# EAGLE schematic 2_dsub to pins (EAGLE 7.2.0)
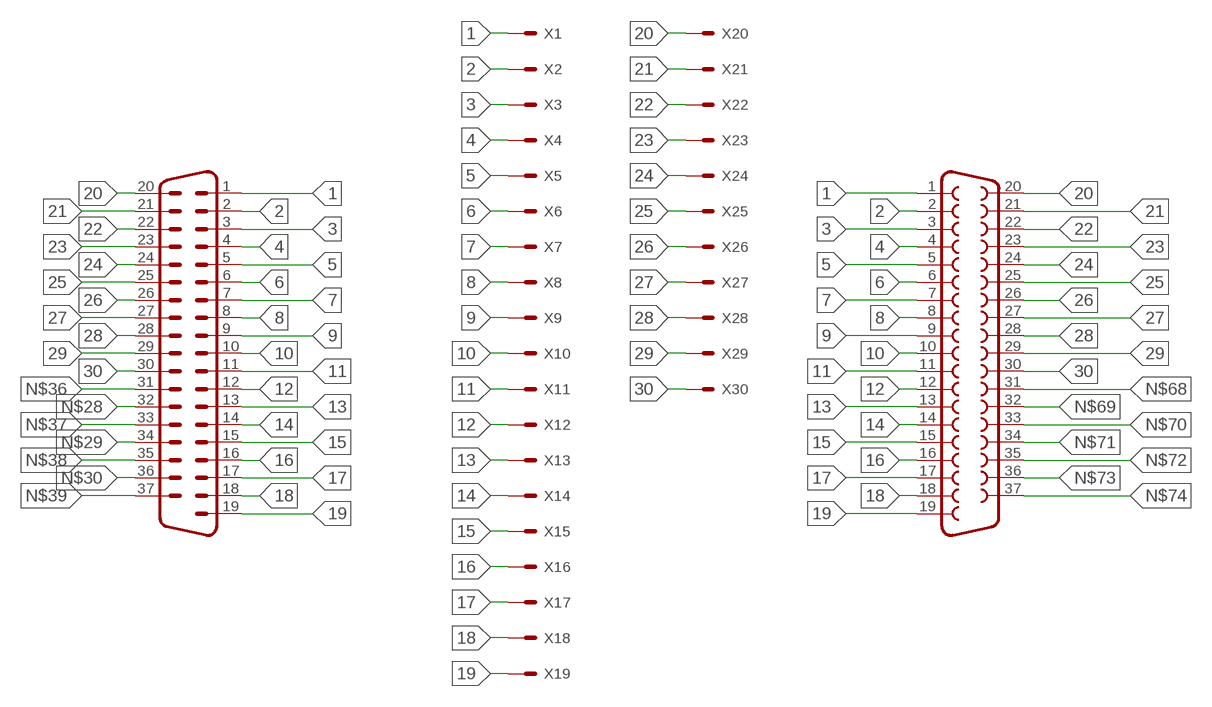
[diagram p0: schematic, sheet 1]

## Parts
X1  22-23-2021  [22-23-2021]
X2  22-23-2021  [22-23-2021]
X3  22-23-2021  [22-23-2021]
X4  22-23-2021  [22-23-2021]
X5  22-23-2021  [22-23-2021]
X6  22-23-2021  [22-23-2021]
X7  22-23-2021  [22-23-2021]
X8  22-23-2021  [22-23-2021]
X9  22-23-2021  [22-23-2021]
X10  22-23-2021  [22-23-2021]
X11  22-23-2021  [22-23-2021]
X12  22-23-2021  [22-23-2021]
X13  22-23-2021  [22-23-2021]
X14  22-23-2021  [22-23-2021]
X15  22-23-2021  [22-23-2021]
X16  22-23-2021  [22-23-2021]
X17  22-23-2021  [22-23-2021]
X18  22-23-2021  [22-23-2021]
X19  22-23-2021  [22-23-2021]
X20  22-23-2021  [22-23-2021]
X21  22-23-2021  [22-23-2021]
X22  22-23-2021  [22-23-2021]
X23  22-23-2021  [22-23-2021]
X24  22-23-2021  [22-23-2021]
X25  22-23-2021  [22-23-2021]
X26  22-23-2021  [22-23-2021]
X27  22-23-2021  [22-23-2021]
X28  22-23-2021  [22-23-2021]
X29  22-23-2021  [22-23-2021]
X30  22-23-2021  [22-23-2021]
X33  M37HP  [M37HP]
X34  F37HP  [F37HP]

## Nets
1: X1.1(S) X33.1 X34.1
2: X2.1(S) X33.2 X34.2
3: X3.1(S) X33.3 X34.3
4: X4.1(S) X33.4 X34.4
5: X5.1(S) X33.5 X34.5
6: X6.1(S) X33.6 X34.6
7: X7.1(S) X33.7 X34.7
8: X8.1(S) X33.8 X34.8
9: X9.1(S) X33.9 X34.9
10: X10.1(S) X33.10 X34.10
11: X11.1(S) X33.11 X34.11
12: X12.1(S) X33.12 X34.12
13: X13.1(S) X33.13 X34.13
14: X14.1(S) X33.14 X34.14
15: X15.1(S) X33.15 X34.15
16: X16.1(S) X33.16 X34.16
17: X17.1(S) X33.17 X34.17
18: X18.1(S) X33.18 X34.18
19: X19.1(S) X33.19 X34.19
20: X20.1(S) X33.20 X34.20
21: X21.1(S) X33.21 X34.21
22: X22.1(S) X33.22 X34.22
23: X23.1(S) X33.23 X34.23
24: X24.1(S) X33.24 X34.24
25: X25.1(S) X33.25 X34.25
26: X26.1(S) X33.26 X34.26
27: X27.1(S) X33.27 X34.27
28: X28.1(S) X33.28 X34.28
29: X29.1(S) X33.29 X34.29
30: X30.1(S) X33.30 X34.30
N$28: X33.32
N$29: X33.34
N$30: X33.36
N$36: X33.31
N$37: X33.33
N$38: X33.35
N$39: X33.37
N$68: X34.31
N$69: X34.32
N$70: X34.33
N$71: X34.34
N$72: X34.35
N$73: X34.36
N$74: X34.37

## Library data of the parts
X1-X30 = mayo:22-23-2021: .100" (2.54mm) Center Header - 1 Pin; MF: MOLEX; MPN: 22-23-2021; OC_FARNELL: 1462926; OC_NEWARK: 25C3832
X33 = con-subd:M37: SUB-D; OC_FARNELL: unknown; OC_NEWARK: unknown
X34 = con-subd:F37: SUB-D; OC_FARNELL: unknown; OC_NEWARK: unknown